# Altium project ESP8266 Xmas Lights.PrjPcb
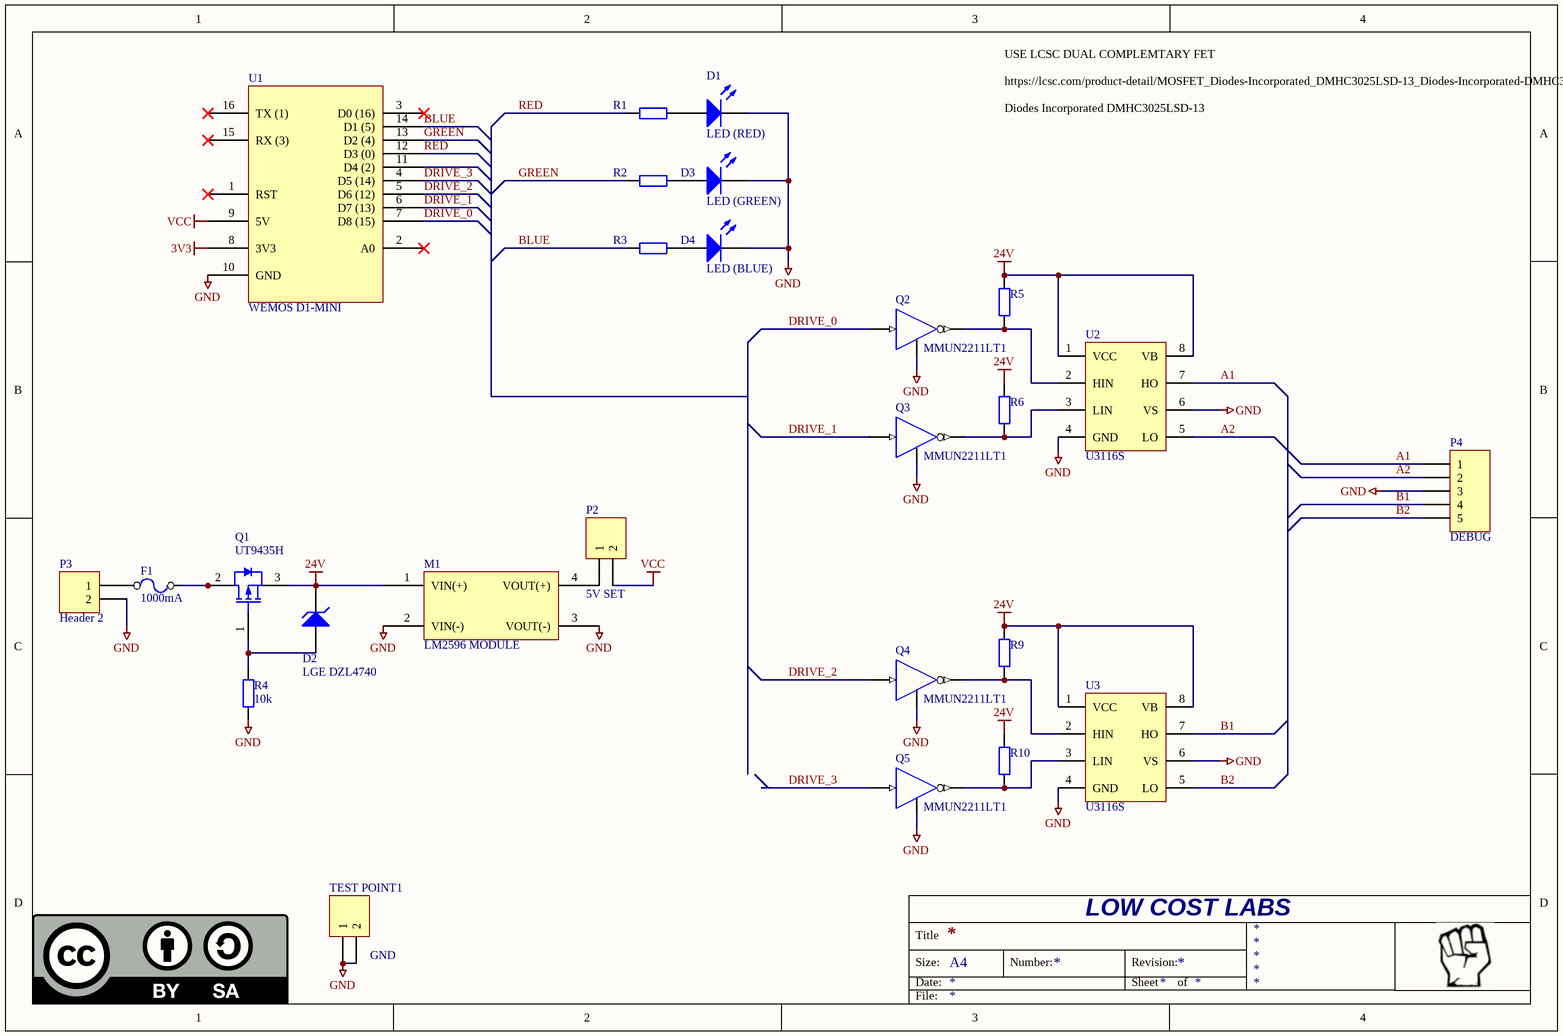
[diagram p0: ESP8266 Xmas Lights.SchDoc]
1 sheet, 26 parts. Net scope: global (net labels, ports and power ports of the same name join across sheets).
Board file: ESP8266 Xmas Lights.PcbDoc

## Sheet ESP8266 Xmas Lights.SchDoc
size A4

### Parts
D1  LED (RED)  [LED(3D) 3MM VERTICAL (RED)]
D2  LGE DZL4740  [SOD-123FL]
D3  LED (GREEN)  [LED(3D) 3MM VERTICAL (GREEN)]
D4  LED (BLUE)  [LED(3D) 3MM VERTICAL (GREEN)]
F1  1000mA  [POLYSWITCH 1210]
M1  LM2596 MODULE  [LM2596 Module]
P2  5V SET  [Pin Header 1x2 TH Pitch 2.54mm]
P3  Header 2  [2 FLYING WIRES]
P4  DEBUG  [5 FLYING WIRES]
Q1  UT9435H  [SOT223]
Q2  MMUN2211LT1  [SOT23-3L]
Q3  MMUN2211LT1  [SOT23-3L]
Q4  MMUN2211LT1  [SOT23-3L]
Q5  MMUN2211LT1  [SOT23-3L]
R1  (no value)  [RESISTOR 0805]
R2  (no value)  [RESISTOR 0805]
R3  (no value)  [RESISTOR 0805]
R4  10k  [RESISTOR 0805]
R5  (no value)  [RESISTOR 0805]
R6  (no value)  [RESISTOR 0805]
R9  (no value)  [RESISTOR 0805]
R10  (no value)  [RESISTOR 0805]
TEST_POINT1  GND  [Pin Header 1x2 TH Pitch 2.54mm]
U1  WEMOS D1-MINI  [WEMOS PRO MINI]
U2  U3116S  [SO-8]
U3  U3116S  [SO-8]

### Nets
3V3: U1.8(3V3)
24V: D2.1(K) M1.1(VIN(+)) Q1.3(S) R5.2 R6.2 R9.2 R10.2 U2.1(VCC) U2.8(VB) U3.1(VCC) U3.8(VB)
GND: D1.2(K) D3.2(K) D4.2(K) M1.2(VIN(-)) M1.3(VOUT(-)) P3.2 P4.3 Q2.2(E) Q3.2(E) Q4.2(E) Q5.2(E) R4.1 TEST_POINT1.1 TEST_POINT1.2 U1.10(GND) U2.4(GND) U2.6(VS) U3.4(GND) U3.6(VS)
VCC: P2.2 U1.9(5V)
A1: P4.1 U2.7(HO)
A2: P4.2 U2.5(LO)
B1: P4.4 U3.7(HO)
B2: P4.5 U3.5(LO)
BLUE: R3.2 U1.14(D1_(5))
DRIVE_0: Q2.1(B) U1.7(D8_(15))
DRIVE_1: Q3.1(B) U1.6(D7_(13))
DRIVE_2: Q4.1(B) U1.5(D6_(12))
DRIVE_3: Q5.1(B) U1.4(D5_(14))
GREEN: R2.1 U1.13(D2_(4))
RED: R1.1 U1.12(D3_(0))
NetD1_1: D1.1(A) R1.2
NetD2_2: D2.2(A) Q1.1(G) R4.2
NetD3_1: D3.1(A) R2.2
NetD4_1: D4.1(A) R3.1
NetF1_1: F1.1 P3.1
NetF1_2: F1.2 Q1.2(D) Q1.4(D)
NetM1_4: M1.4(VOUT(+)) P2.1
NetQ2_3: Q2.3(C) R5.1 U2.2(HIN)
NetQ3_3: Q3.3(C) R6.1 U2.3(LIN)
NetQ4_3: Q4.3(C) R9.1 U3.2(HIN)
NetQ5_3: Q5.3(C) R10.1 U3.3(LIN)

Not connected (* = marked no-connect by the designer): U1 1(RST)* 2(A0)* 3(D0_(16))* 11(D4_(2)) 15(RX_(3))* 16(TX_(1))*

### Notes on the sheet
- USE LCSC DUAL COMPLEMTARY FET
  https://lcsc.com/product-detail/MOSFET_Diodes-Incorporated_DMHC3025LSD-13_Diodes-Incorporated-DMHC3025LSD-13_C156387.html
  Diodes Incorporated DMHC3025LSD-13
- LOW COST LABS
- Title
- Size:
- Date:
- A4
- Number:
- Revision:
- Sheet
- of
- File:

### Library data of the parts
D1 D3 D4 = LED 3mm RED: 3mm RED LED; Manufacturer: Kingbright; Manufacturer Part No.: WP132XIT; Mouser Part no.: 604-WP132XIT; Farnell Part no.: 1003393; Web link: http://au.mouser.com/Search/Refine.aspx?Keyword=604-WP132XIT
D2 = LGE DZL4740: 10V 1W 10uA @ 7.6V SOD-123FL Zener Diode; Manufacturer Part Number: 1N4733A; Output Current: 510 mA (max); Material: Glass; Power Rating: 1.00 W; Breakdown Voltage: 5.10 V; Lead-Free Status: Lead Free; REACH SVHC Compliance: No SVHC; Mounting Style: Through Hole; RoHS: Compliant; Voltage Rating (DC): 5.10 V; Lifecycle Status: Active; Octopart URL: http://octopart.com/1n4733a-multicomp-19660330; Number of Pins: 2; Packaging: Bulk; Power Dissipation: 1.00 W; OctopartID: 43988bb998d49c5f; Case/Package: DO-41
F1 = PTC 12V POLYFUSE SMT 1210 1.10A: PTC 12V POLYFUSE SMT 1210 500mA (1210L110/12WR); Value: 1000mA
P2 P3 TEST_POINT1 = Header 2: Header, 2-Pin; Manufacturer: FCI; Manufacturer Part No.: 68020-102; Mouser Part no.: 649-68020-102; Web link: http://au.mouser.com/ProductDetail/FCI/68020-102/?qs=sGAEpiMZZMs%252bGHln7q6pm44kDepmYTI87r6%2fnQtKGLI%3d
P4 = Header 5: Header, 5 Pin; Manufacturer: FCI; Manufacturer Part No.: 68020-102; Mouser Part no.: 649-68020-102; Web link: http://au.mouser.com/ProductDetail/FCI/68020-102/?qs=sGAEpiMZZMs%252bGHln7q6pm44kDepmYTI87r6%2fnQtKGLI%3d
Q1 = UT9435H: UT9435H P-CHANNEL ENHANCEMENT MODE; Manufacturer Part Number: NDP6020P; Drain to Source Voltage (Vds): -20.0 V; Continuous Drain Current (Ids): -24.0 A; Power Dissipation: 50.0 W; Lead-Free Status: Lead Free; Drain to Source Resistance (on) (Rds): 75.0 m?; Polarity: P-Channel; OctopartID: d65e1f9ca3c10999; Octopart URL: http://octopart.com/ndp6020p-fairchild+semiconductor-13127929; RoHS: Compliant; Current Rating: -24.0 A; REACH SVHC Compliance: No SVHC; Lifecycle Status: Active; Packaging: Tube; Voltage Rating (DC): -20.0 V; Number of Pins: 3; Case/Package: TO-220; Mounting Style: Through Hole
Q2-Q5 = MMUN221LT1 NPN DIGITAL TRANSISTOR: Manufacturer: ON Semiconductor; Manufacturer Part No.: MMUN2211LT1G; Mouser Part no.: 863-MMUN2211LT1G; Farnell Part no.: 9556648RL; Web link: http://au.mouser.com/ProductDetail/ON-Semiconductor/MMUN2211LT1G/?qs=sGAEpiMZZMt32xmUYxteeYvHZcSNQKJZCO%252bIh%252bS%252bXZs%3d
R1-R6 R9 R10 = Res2: Resistor; Published: 8-Jun-2000; LatestRevisionDate: 17-Jul-2002; LatestRevisionNote: Re-released for DXP Platform.; PackageReference: AXIAL-0.4; Publisher: Altium Limited; PackageDescription: Axial Device, Thru-Hole; 2 Leads; 0.4 in Pin Spacing
  R4: Value: 10k
U1 = WEMOS
U2 U3 = U3116S: U3116S High Current IO+/- 1.2/1.5A HALF-BRIDGE DRIVER